# Altium schematic sheet PCBProject_AdapterBoard_NTUInv.SchDoc
size A4
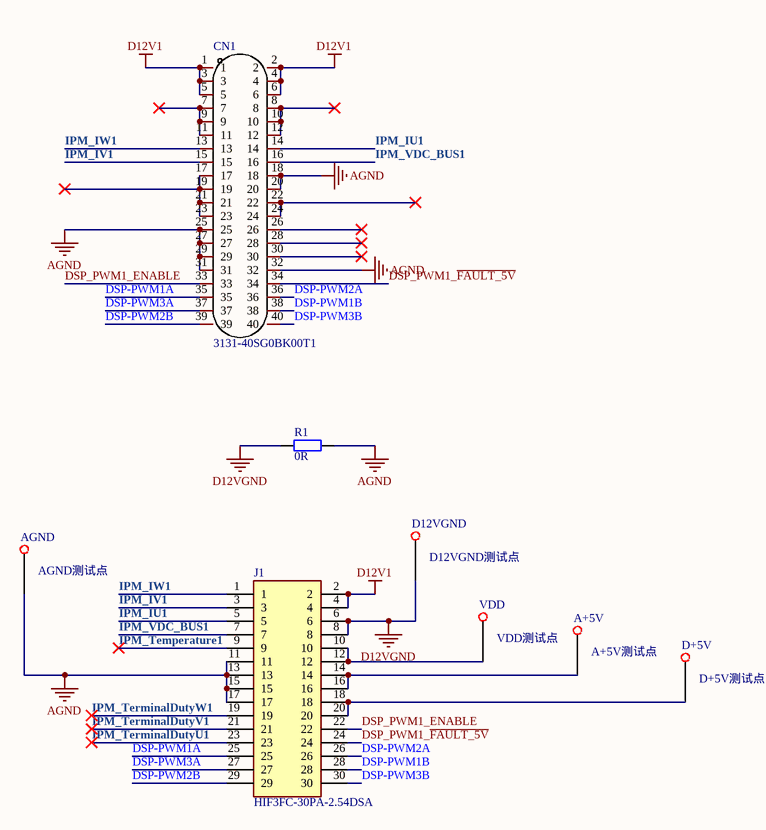
[diagram p0: PCBProject_AdapterBoard_NTUInv.SchDoc]

## Parts
A+5V  A+5V测试点  [TP]
AGND  AGND测试点  [TP]
CN1  3131-40SG0BK00T1  [IDC-TH_3131-40SG0BK00T1]
D12VGND  D12VGND测试点  [TP]
D+5V  D+5V测试点  [TP]
J1  HIF3FC-30PA-2.54DSA  [SHDR30W50P254_2X15_4560X850X1200P]
R1  0R  [0805]
VDD  VDD测试点  [TP]

## Nets
AGND: AGND.1 CN1.18 CN1.20 CN1.25 CN1.27 CN1.29 CN1.31 CN1.32 J1.11 J1.13 J1.15 J1.17 R1.2
D12V1: CN1.1 CN1.2 CN1.3 CN1.4 CN1.5 CN1.6 J1.2 J1.4
D12VGND: D12VGND.1 J1.6 J1.8 R1.1
DSP-PWM1A: CN1.35 J1.25
DSP-PWM1B: CN1.38 J1.28
DSP-PWM2A: CN1.36 J1.26
DSP-PWM2B: CN1.39 J1.29
DSP-PWM3A: CN1.37 J1.27
DSP-PWM3B: CN1.40 J1.30
DSP_PWM1_ENABLE: CN1.33 J1.22
DSP_PWM1_~{FAULT_5V}: CN1.34 J1.24
IPM_IU1: CN1.14 J1.5
IPM_IV1: CN1.15 J1.3
IPM_IW1: CN1.13 J1.1
IPM_Temperature1: J1.9
IPM_TerminalDutyU1: J1.23
IPM_TerminalDutyV1: J1.21
IPM_TerminalDutyW1: J1.19
IPM_VDC_BUS1: CN1.16 J1.7
NetA+5V_1: A+5V.1 J1.14 J1.16
NetCN1_7: CN1.7 CN1.9 CN1.11
NetCN1_8: CN1.8 CN1.10 CN1.12
NetCN1_17: CN1.17 CN1.19 CN1.21 CN1.23
NetCN1_22: CN1.22 CN1.24
NetD+5V_1: D+5V.1 J1.18 J1.20
NetJ1_10: J1.10 J1.12 VDD.1

Not connected (* = marked no-connect by the designer): CN1 26* 28* 30*

## Library data of the parts
A+5V AGND D12VGND D+5V VDD = 测试点
CN1 = 3131-40SG0BK00T1: 连接器类型:简牛座;每排PIN数:20;排数:2;间距:1.27mm;行距:1.27mm;封装形式:直插;触头材质:黄铜;触头镀层:金;; Manufacturer: Wcon(维峰电子); Add into BOM: yes; Connector Type: 简牛座; Pin Number in each Row: 20; Pitch: 1.27mm; Holder Type: 直插; Name: 3131-40SG0BK00T1; Symbol: 3131-40SG0BK00T1; Device: 3131-40SG0BK00T1; LCSC Part Name: 每排P数:20 排数:2 1.27mm; Supplier Part: C976754; Manufacturer Part: 3131-40SG0BK00T1; Supplier Footprint: 插件,P=1.27mm; JLCPCB Part Class: Extended Part; Datasheet: https://atta.szlcsc.com/upload/public/pdf/source/20210304/C976754_BF257D3FF426E047B764690466F062CF.pdf; Supplier: LCSC; Convert to PCB: yes; Number of Rows: 2; Row Spacing: 1.27mm; Contact Material: 黄铜; Contact Plating: 金
J1 = HIF3FC-30PA-2.54DSA: Connector; Manufacturer_Name: Hirose; Manufacturer_Part_Number: HIF3FC-30PA-2.54DSA(71); Datasheet Link: https://datasheet.datasheetarchive.com/originals/distributors/SFDatasheet-7/sf-000141320.pdf; Height: 12mm; Mouser Part Number: 798-HIF3FC30PA254D71; Mouser Price/Stock: https://www.mouser.co.uk/ProductDetail/Hirose-Connector/HIF3FC-30PA-254DSA71?qs=eDUdFcBPps32%2FyAdBVx6ww%3D%3D; System: Connector
R1 = Res2: Resistor; Published: 8-Jun-2000; LatestRevisionDate: 17-Jul-2002; LatestRevisionNote: Re-released for DXP Platform.; PackageReference: AXIAL-0.4; Publisher: Altium Limited